# EAGLE design Stepper Motor Driver v1.1 (EAGLE 7.2.0)
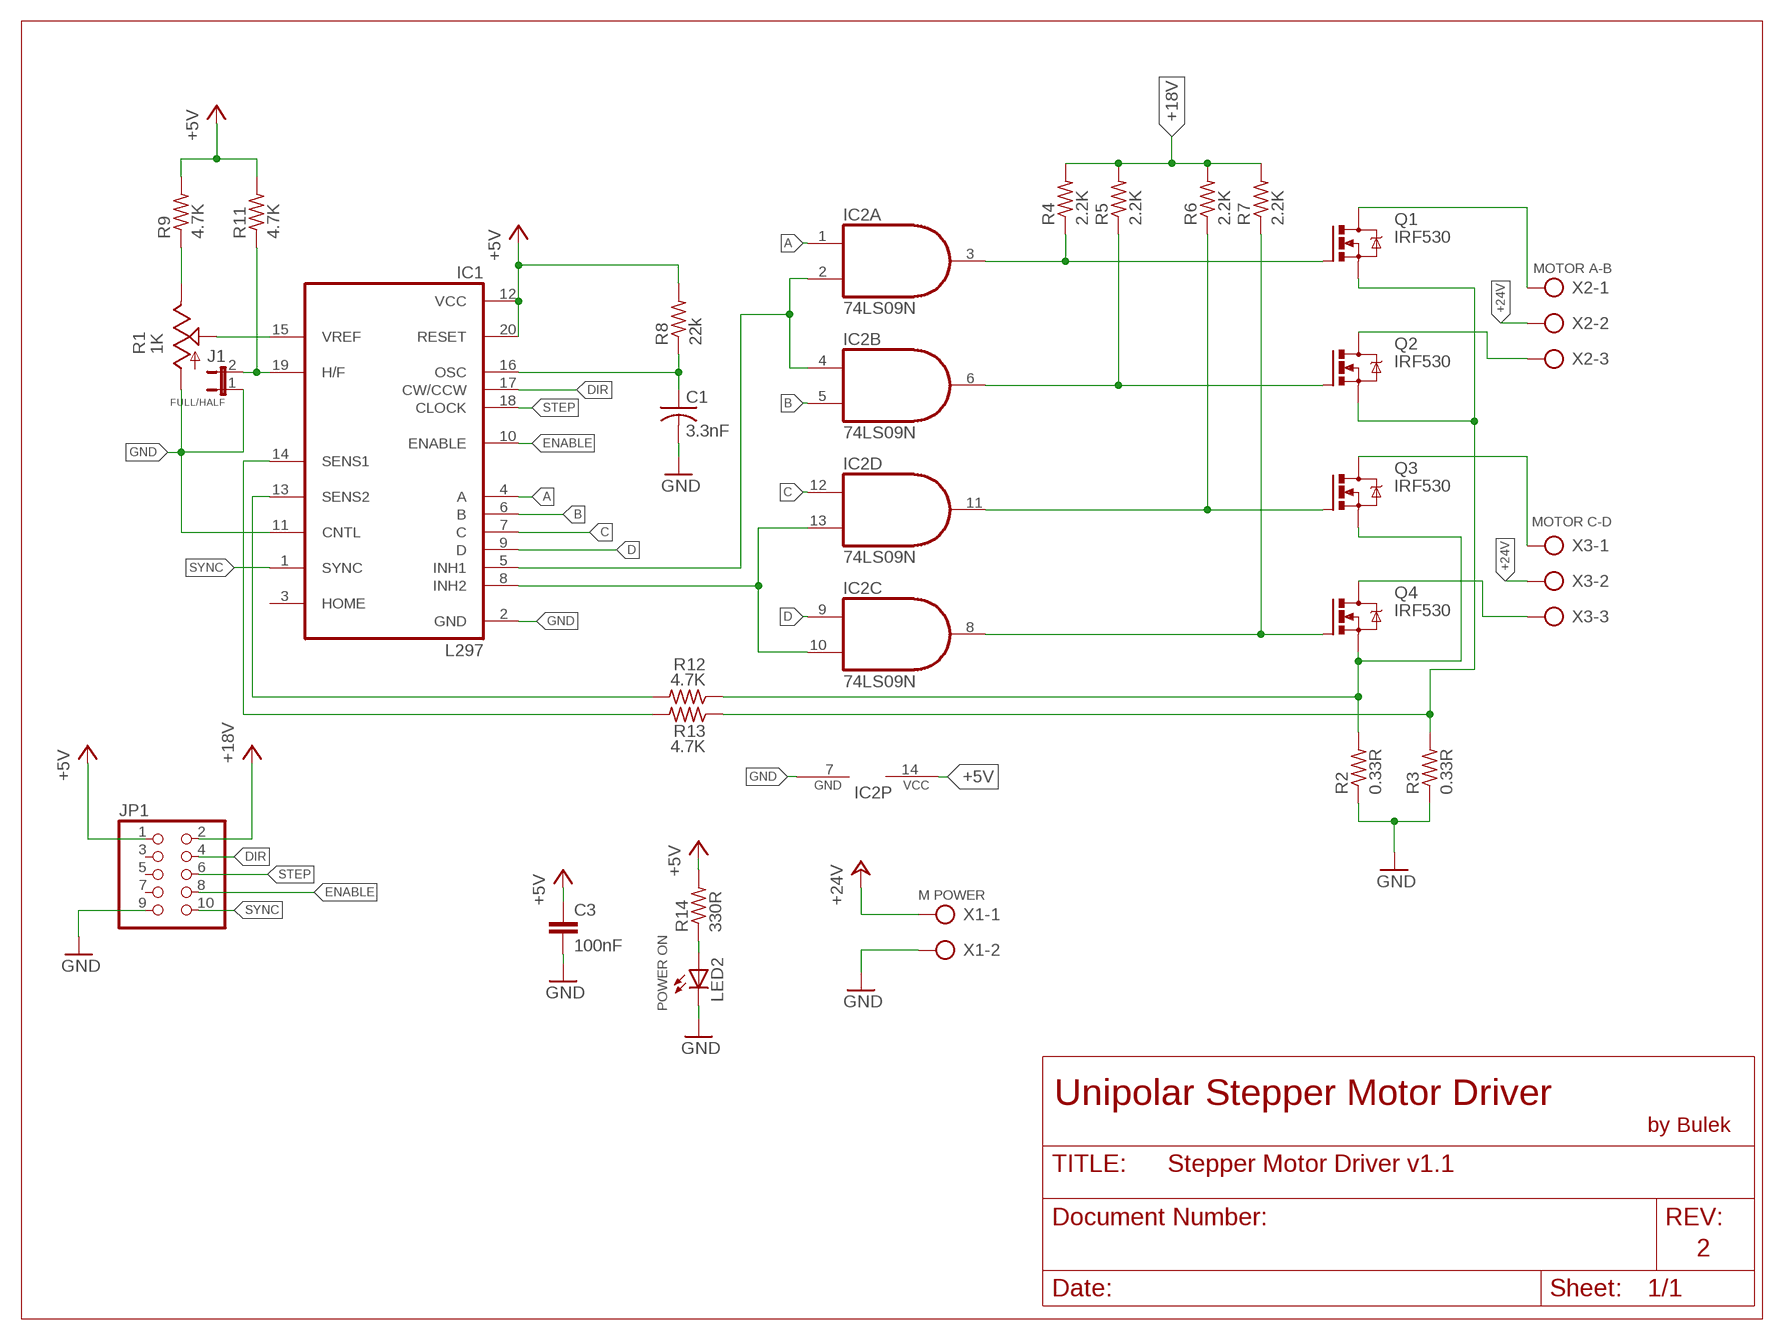
[diagram p0: schematic, sheet 1]

## Parts
C1  3.3nF  C-US025-024X044  [C025-024X044]
C3  100nF  C-EU025-025X050  [C025-025X050]
FULL/HALF  J1  JP1E  [JP1]
IC1  L297  [DIL20]
IC2  74LS09N  [DIL14]
JP1  PINHD-2X5  [2X05]
LED2  POWER ON  LED5MM  [LED5MM]
Q1  IRF530  [TO220BV]
Q2  IRF530  [TO220BV]
Q3  IRF530  [TO220BV]
Q4  IRF530  [TO220BV]
R1  1K  TRIM_US-S63X  [S63X]
R2  0.33R  R-US_0617/22  [0617/22]
R3  0.33R  R-US_0617/22  [0617/22]
R4  2.2K  R-US_0207/10  [0207/10]
R5  2.2K  R-US_0207/10  [0207/10]
R6  2.2K  R-US_0207/10  [0207/10]
R7  2.2K  R-US_0207/10  [0207/10]
R8  22k  R-US_0207/10  [0207/10]
R9  4.7K  R-US_0207/10  [0207/10]
R11  4.7K  R-US_0207/10  [0207/10]
R12  4.7K  R-US_0207/10  [0207/10]
R13  4.7K  R-US_0207/10  [0207/10]
R14  330R  R-US_0207/10  [0207/10]
X1  M POWER  AK300/2  [AK300/2]
X2  MOTOR A-B  AK300/3  [AK300/3]
X3  MOTOR C-D  AK300/3  [AK300/3]

## Nets
+5V: C3.1 IC1.12(VCC) IC1.20(RESET) IC2.14(P:VCC) JP1.1 R8.2 R9.2 R11.2 R14.2
+18V: JP1.2 R4.2 R5.2 R6.2 R7.2
+24V [POWER]: X1.1 X2.2 X3.2
A: IC1.4(A) IC2.1(A:I0)
B: IC1.6(B) IC2.5(B:I1)
C: IC1.7(C) IC2.12(D:I0)
D: IC1.9(D) IC2.9(C:I0)
DIR: IC1.17(CW/CCW) JP1.4
ENABLE: IC1.10(ENABLE) JP1.8
GND [GND]: C1.2 C3.2 FULL/HALF.1 IC1.2(GND) IC1.11(CNTL) IC2.7(P:GND) JP1.9 LED2.K(C) R1.A R2.1 R3.1 X1.2
INH1: IC1.5(INH1) IC2.2(A:I1) IC2.4(B:I0)
INH2: IC1.8(INH2) IC2.10(C:I1) IC2.13(D:I1)
N$1: R1.E R9.1
N$2: IC1.15(VREF) R1.S
N$3: C1.1 IC1.16(OSC) R8.1
N$6: FULL/HALF.2 IC1.19(H/F) R11.1
N$7: IC1.14(SENS1) R13.2
N$8: IC1.13(SENS2) R12.2
N$9: IC2.3(A:O) Q1.G R4.1
N$10: IC2.6(B:O) Q2.G R5.1
N$11: IC2.11(D:O) Q3.G R6.1
N$12: IC2.8(C:O) Q4.G R7.1
N$13 [POWER]: Q1.S Q2.S R3.2 R13.1
N$14 [POWER]: Q3.S Q4.S R2.2 R12.1
N$15 [POWER]: Q1.D X2.1
N$16 [POWER]: Q2.D X2.3
N$17 [POWER]: Q3.D X3.1
N$18 [POWER]: Q4.D X3.3
N$20: LED2.A R14.1
STEP: IC1.18(CLOCK) JP1.6
SYNC: IC1.1(SYNC) JP1.10
Unconnected: IC1.3(HOME) JP1.3 JP1.5 JP1.7

## Notes on the sheet
- Unipolar Stepper Motor Driver
- by Bulek
- 2

## Library data of the parts
C1 = rcl:C-US: CAPACITOR, American symbol
C3 = rcl:C-EU: CAPACITOR, European symbol
FULL/HALF = jumper:JP1E: JUMPER
IC1 = st-microelectronics:L297: STEPPER MOTOR CONTROLLER; MPN: L297/1; OC_FARNELL: 1094209; OC_NEWARK: 56P8258
IC2 = 74xx-us:74*09: Quad 2-input AND gate, open collector
JP1 = pinhead:PINHD-2X5: PIN HEADER
LED2 = led:LED: LED OSRAM: - CHIPLED LG R971, LG N971, LY N971, LG Q971, LY Q971, LO R971, LY R971 LH N974, LH R974 LS Q976, LO Q976, LY Q976 LO Q996 - Hyper CHIPLED LW Q18S LB Q993, LB Q99A, LB R99A - SideLED LS A670, LO A670, LY A670, LG A670, LP A670 LB A673, LV A673, LT A673, LW A673 LH A674 LY A675 LS A676, LA A676, LO A676, LY A676, LW A676 LS A679, LY A679, LG A679 - Hyper Micro SIDELED® LS Y876, LA Y876, LO Y876, LY Y876 LT Y87S - SmartLED LW L88C, LW L88S LB L89C, LB L89S, LG L890 LS L89K, LO L89K, LY L89K LS L896, LA L896, LO L896, LY L896 - TOPLED LS T670, LO T670, LY T670, LG T670, LP T670 LSG T670, LSP T670, LSY T670, LOP T670, LYG T670 LG T671, LOG T671, LSG T671 LB T673, LV T673, LT T673, LW T673 LH T674 LS T676, LA T676, LO T676, LY T676, LB T676, LH T676, LSB T676, LW T676 LB T67C, LV T67C, LT T67C, LS T67K, LO T67K, LY T67K, LW E67C LS E67B, LA E67B, LO E67B, LY E67B, LB E67C, LV E67C, LT E67C LW T67C LS T679, LY T679, LG T679 LS T770, LO T770, LY T770, LG T770, LP T770 LB T773, LV T773, LT T773, LW T773 LH T774 LS E675, LA E675, LY E675, LS T675 LS T776, LA T776, LO T776, LY T776, LB T776 LHGB T686 LT T68C, LB T68C - Hyper Mini TOPLED® LB M676 - Mini TOPLED Santana® LG M470 LS M47K, LO M47K, LY M47K Source: http://www.osram.convergy.de LUXEON: - LUMILED® LXK2-PW12-R00, LXK2-PW12-S00, LXK2-PW14-U00, LXK2-PW14-V00 LXK2-PM12-R00, LXK2-PM12-S00, LXK2-PM14-U00 LXK2-PE12-Q00, LXK2-PE12-R00, LXK2-PE12-S00, LXK2-PE14-T00, LXK2-PE14-U00 LXK2-PB12-K00, LXK2-PB12-L00, LXK2-PB12-M00, LXK2-PB14-N00, LXK2-PB14-P00, LXK2-PB14-Q00 LXK2-PR12-L00, LXK2-PR12-M00, LXK2-PR14-Q00, LXK2-PR14-R00 LXK2-PD12-Q00, LXK2-PD12-R00, LXK2-PD12-S00 LXK2-PH12-R00, LXK2-PH12-S00 LXK2-PL12-P00, LXK2-PL12-Q00, LXK2-PL12-R00 Source: www.luxeon.com KINGBRIGHT: KA-3528ASYC Source: www.kingbright.com
Q1-Q4 = transistor-power:IRF530: HEXFET Power MOSFET
R1 = pot:TRIM_US-: POTENTIOMETER
R2-R9 R11-R14 = resistor:R-US_: RESISTOR, American symbol
X1 = con-ptr500:AK300/2: CONNECTOR; OC_FARNELL: unknown; OC_NEWARK: unknown
X2 X3 = con-ptr500:AK300/3: CONNECTOR; OC_FARNELL: unknown; OC_NEWARK: unknown

## Net classes
0 default: width 1.219 mm
1 GND: width 1.626 mm
2 POWER: width 1.626 mm

## Board
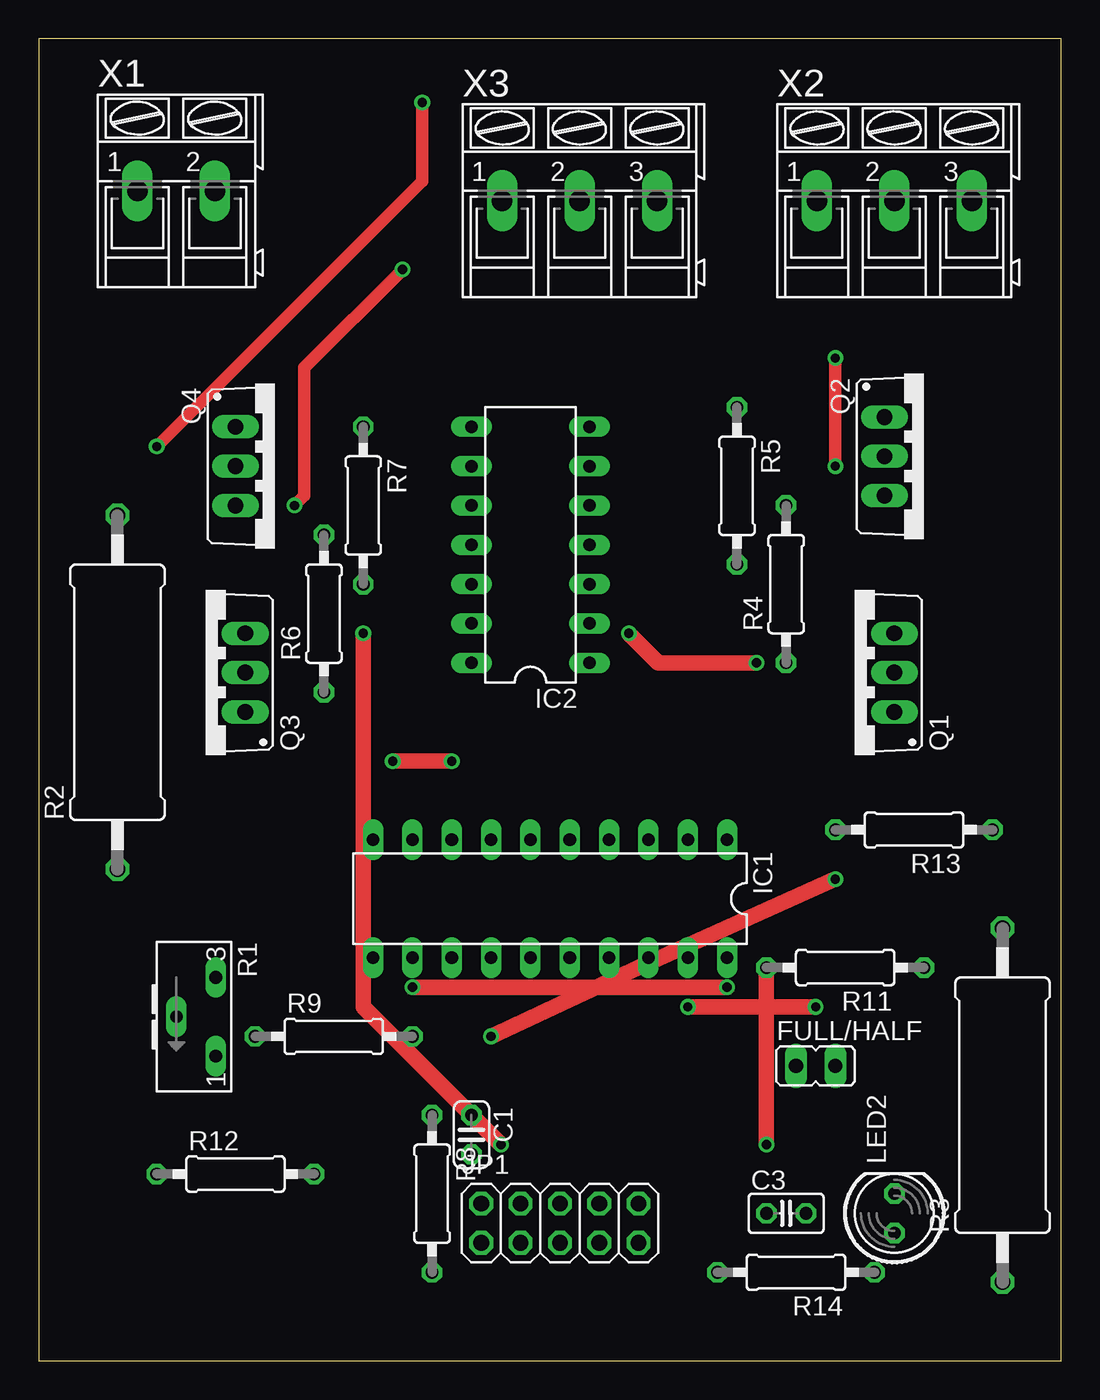
[diagram p1: board, top side]
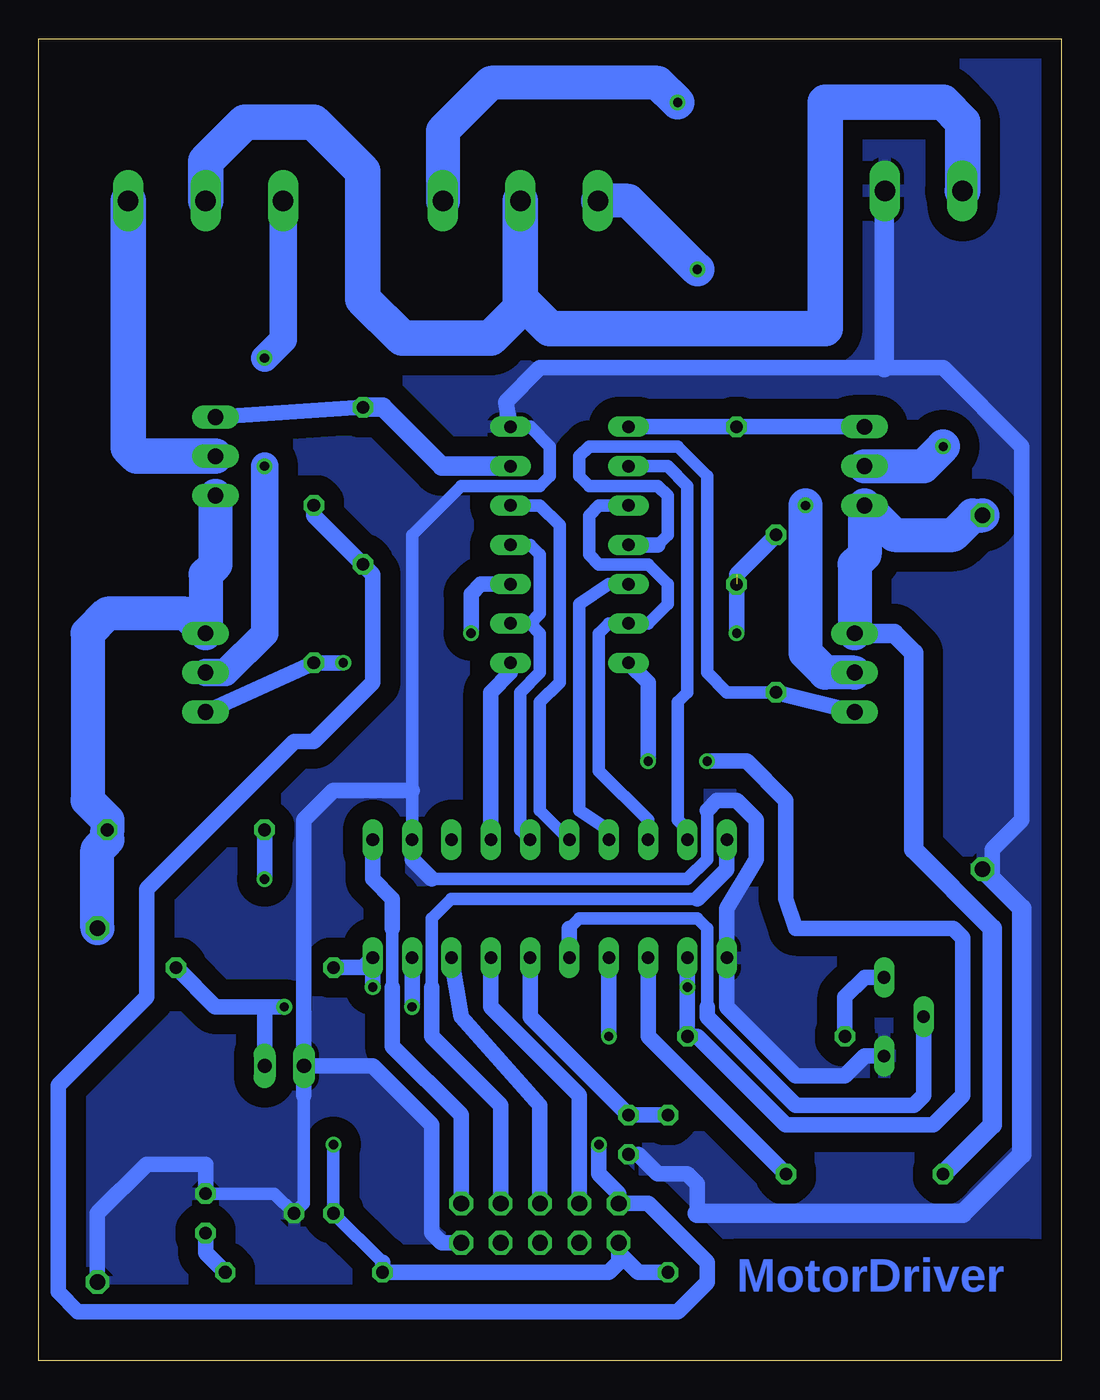
[diagram p2: board, bottom side, seen from below]

Size 66.02 x 85.4 mm. Coordinates in mm from the lower left corner, seen from the top.
Outline: 0,0 66.02,0 66.02,85.4 0,85.4 0,0
Copper layers (1*16): Top 0.035mm / dielectric 1.5mm / Bottom 0.035mm
Design rules "default": minimum track width 10mil, minimum drill 24mil, track to track 8mil, track to pad 8mil, pad to pad 8mil, via to via 8mil, smd to smd 8mil, copper to edge 40mil, drill to drill 8mil, minimum pad ring 10mil, minimum via ring 8mil, stop-mask expansion 4mil, vias tented up to drill 0mil, thermal gap 10mil

### Footprints (pad centres in the part's own frame; a part is rotated, then mirrored left to right if it is on the bottom)
C025-024X044 = drill 0.813 octagon: 1 -1.27,0; 2 1.27,0
C025-025X050 = drill 0.813 octagon: 1 -1.27,0; 2 1.27,0
JP1 = drill 0.914 long: 1 0,-1.27; 2 0,1.27
DIL20 = drill 0.813 long: 1 -11.43,-3.81; 2 -8.89,-3.81; 3 -6.35,-3.81; 4 -3.81,-3.81; 5 -1.27,-3.81; 6 1.27,-3.81; 7 3.81,-3.81; 8 6.35,-3.81; 9 8.89,-3.81; 10 11.43,-3.81; 11 11.43,3.81; 12 8.89,3.81; 13 6.35,3.81; 14 3.81,3.81; 15 1.27,3.81; 16 -1.27,3.81; 17 -3.81,3.81; 18 -6.35,3.81; 19 -8.89,3.81; 20 -11.43,3.81
DIL14 = drill 0.813 long: 1 -7.62,-3.81; 2 -5.08,-3.81; 3 -2.54,-3.81; 4 0,-3.81; 5 2.54,-3.81; 6 5.08,-3.81; 7 7.62,-3.81; 8 7.62,3.81; 9 5.08,3.81; 10 2.54,3.81; 11 0,3.81; 12 -2.54,3.81; 13 -5.08,3.81; 14 -7.62,3.81
2X05 = drill 1.016 octagon: 1 -5.08,-1.27; 2 -5.08,1.27; 3 -2.54,-1.27; 4 -2.54,1.27; 5 0,-1.27; 6 0,1.27; 7 2.54,-1.27; 8 2.54,1.27; 9 5.08,-1.27; 10 5.08,1.27
LED5MM = drill 0.813 octagon: A -1.27,0; K 1.27,0
TO220BV = drill 1.016 long: D 0,-2.54; G -2.54,-2.54; S 2.54,-2.54
S63X = drill 0.813 long: A 2.54,0; E -2.54,0; S 0,-2.54
0617/22 = drill 1.016 octagon: 1 -11.43,0; 2 11.43,0
0207/10 = drill 0.813 octagon: 1 -5.08,0; 2 5.08,0
AK300/2 = drill 1.321 long: 1 -2.515,0; 2 2.489,0
AK300/3 = drill 1.321 long: 1 -5.004,0; 2 0,0; 3 5.004,0

### Placement (x,y rotation side)
C1  27.94,14.61 270 top
C3  48.26,9.53 0 top
FULL/HALF  50.16,19.05 270 top
IC1  33.02,29.85 180 top
IC2  31.75,52.7 90 top
JP1  33.66,8.89 0 top
LED2  55.24,9.53 90 top
Q1  52.7,44.45 90 top
Q2  57.15,58.42 270 top
Q3  10.79,44.45 90 top
Q4  15.24,57.78 270 top
R1  11.43,22.23 270 top
R2  5.08,43.18 90 top
R3  62.23,16.51 90 top
R4  48.26,50.16 90 top
R5  45.09,56.52 270 top
R6  18.41,48.26 90 top
R7  20.95,55.24 270 top
R8  25.4,10.79 270 top
R9  19.05,20.96 0 top
R11  52.07,25.4 180 top
R12  12.7,12.06 0 top
R13  56.52,34.29 180 top
R14  48.9,5.71 180 top
X1  8.89,75.57 0 top
X2  55.24,74.93 0 top
X3  34.92,74.93 0 top

### Tracks (layer width: path | path; a pad name or v marks a point on that pad's centre or on a via)
+5V  (via drill 0.6)
  Top 1.016: v46.99,13.97 R11.2 | v24.13,24.13 v44.45,24.13 | v26.67,38.73 v22.86,38.73
  Bottom 0.813: v46.99,13.97 C3.1 43.81,6.35
  Bottom 1.016: JP1.1 28.57,6.98 | 28.57,6.98 28.57,6.35 29.21,5.71 R14.2 43.81,6.35 | R8.2 27.3,5.71 28.57,6.98 | R11.2 45.09,25.4 | 45.09,25.4 IC1.20 | 45.09,25.4 44.45,25.4 v44.45,24.13 | IC2.14 26.67,43.81 v26.67,38.73 | v22.86,38.73 20.32,38.73 17.78,36.2 17.78,29.85 17.14,27.94 6.99,27.94 6.35,27.31 6.35,17.15 8.26,15.24 17.78,15.24 23.5,20.96 R9.2 v24.13,24.13 IC1.12
  other vias: 46.99,25.4
+18V  (via drill 0.6)  (1 unrouted)
  Top 1.016: v29.84,13.97 20.95,22.86 v20.95,46.99
  Bottom 1.016: R4.2 48.26,54.61 R5.2 44.45,50.8 44.45,43.81 48.26,40 49.53,40 59.05,30.48 59.05,23.5 64.77,17.78 64.77,4.45 63.5,3.17 24.77,3.17 22.86,5.08 22.86,6.35 26.67,10.16 JP1.2 28.57,10.79 29.84,12.06 v29.84,13.97 | R6.2 20.95,50.8 v20.95,46.99
+24V
  Bottom 2.286: X1.1 6.35,75.59 6.35,80.01 7.62,81.28 15.24,81.28 15.24,66.68 33.02,66.68 34.92,68.58 X3.2 34.92,67.95 36.83,66.04 42.55,66.04 45.09,68.58 45.09,76.84 48.26,80.01 52.7,80.01 55.24,77.47 X2.2
A
  Bottom 1.016: IC1.4 36.83,43.18 35.56,44.45 IC2.1
B
  Bottom 0.813: IC1.6 33.66,35.56 33.66,42.54 32.38,43.81 32.38,53.98 33.66,55.24 IC2.5
C
  Bottom 0.813: IC2.12 29.21,50.16 31.11,48.89 31.11,35.56 29.21,34.29 IC1.7
D
  Bottom 0.813: IC1.9 24.13,34.29 24.77,34.92 24.77,42.54 24.13,43.18 24.13,56.52 25.4,57.78 IC2.9
DIR
  Bottom 1.016: JP1.4 31.11,17.15 36.83,22.86 IC1.17
ENABLE
  Bottom 0.813: 23.5,29.85 39.37,29.85 40.64,28.58 40.64,24.13
  Bottom 1.016: IC1.10 21.59,31.75 23.5,29.85 | 40.64,24.13 40.64,20.96 36.2,16.51 JP1.8
GND
  Bottom 0.813: 22.86,35.56 22.86,32.38 24.13,31.12 40.64,31.12 | IC1.2 41.91,36.83 41.91,53.34 38.73,56.52 33.66,56.52 33.02,57.15 33.02,59.05 34.29,60.32 IC2.7 35.88,60.64 35.88,61.91 | 48.9,18.42 48.9,10.16 C3.2 50.8,10.79 LED2.K
  Bottom 1.016: 22.86,35.56 22.23,36.2 20.95,36.2 19.68,34.92 19.68,32.38 21.59,29.21 IC1.11 21.59,22.86 17.14,18.42 13.97,18.42 12.7,19.69 R1.A | 40.64,31.12 41.91,32.38 IC1.2 | JP1.9 40.01,7.62 40.64,8.26 40.64,15.24 44.45,19.05 FULL/HALF.1 | 27.3,13.33 26.04,12.06 24.13,12.06 23.5,11.43 23.5,9.53 | 48.9,17.15 48.9,18.42 FULL/HALF.1 | 2.54,29.21 4.45,31.12 4.45,33.02 2.54,34.92 2.54,59.05 7.62,64.14 11.43,64.14 33.66,64.14 35.88,61.91 IC2.7 | R3.1 62.23,9.53 59.05,12.7 55.24,12.7 LED2.K | FULL/HALF.1 48.9,34.92 46.99,36.83 41.91,36.83
  Bottom 1.27: R2.1 2.54,29.21 2.54,13.33 6.35,9.53 23.5,9.53 | X1.2 11.43,75.51 11.43,64.14
  pour Bottom (isolate 1.27): 0.64,85.09 0.64,1.27 66.04,1.27 66.04,85.09
INH1
  Bottom 0.813: IC1.5 34.92,34.29 34.92,43.18 33.66,44.45 33.66,46.99 34.29,47.62 | IC2.2 34.29,47.62 | 34.29,47.62 33.66,48.26 33.66,52.07 34.29,52.7 IC2.4
INH2
  Bottom 0.813: IC1.8 26.67,34.92 29.84,38.1 29.84,46.99 29.21,47.62 IC2.13 26.67,47.62 25.4,48.89 25.4,50.16 26.67,51.43 29.84,51.43 30.48,52.07 30.48,54.61 29.84,55.24 IC2.10
N$1
  Bottom 1.016: R9.1 13.97,23.5 12.7,24.77 R1.E
N$2
  Bottom 0.813: 31.75,27.94 31.11,28.58 23.5,28.58 22.86,27.94 22.86,22.86
  Bottom 1.016: IC1.15 31.75,27.94 | 22.86,22.86 22.86,22.23 17.14,16.51 9.53,16.51 8.89,17.15 R1.S
N$3
  Bottom 1.016: R8.1 C1.1 34.29,22.23 IC1.16
N$6  (via drill 0.6)
  Top 1.016: v41.91,22.86 v50.16,22.86
  Bottom 1.016: IC1.19 v41.91,22.86 | v50.16,22.86 51.44,22.86 | 51.44,22.86 FULL/HALF.2 | 51.44,22.86 54.61,22.86 R11.1
N$7  (via drill 0.6)
  Top 1.016: v51.44,31.12 38.73,25.4 v29.21,20.96
  Bottom 1.016: R13.2 v51.44,31.12 | v29.21,20.96 IC1.14
N$8
  Bottom 1.016: R12.2 26.67,20.96 IC1.13
N$9  (via drill 0.6)
  Top 1.016: v38.1,46.99 40.01,45.09 v46.35,45.09
  Bottom 1.016: IC2.3 37.47,50.16 38.1,49.53 v38.1,46.99 | v46.35,45.09 R4.1 Q1.G
N$10
  Bottom 1.016: R5.1 Q2.G
  Bottom 1.27: IC2.6 40.01,57.78 43.81,61.59 R5.1
N$11
  Bottom 0.813: 26.04,52.7 25.4,53.34 25.4,55.88 26.04,56.52 30.48,56.52 31.11,57.15 31.11,58.42 30.48,59.05 24.77,59.05 22.86,57.15 22.86,44.45 21.59,43.18 R6.1
  Bottom 1.016: IC2.11 26.04,52.7 | R6.1 Q3.G
N$12
  Bottom 1.016: Q4.G R7.1 IC2.8
N$13
  Bottom 2.184: Q2.S 54.61,51.43 55.24,50.8 Q1.S 56.52,48.26 61.59,48.26 62.87,46.99 62.87,36.2 61.59,34.92 R13.1 61.59,33.66 62.23,33.02 R3.2
N$14
  Bottom 1.27: R12.1 4.45,15.24 4.45,27.94 9.53,33.02 9.53,45.72 10.79,46.99 Q3.S
  Bottom 2.184: Q3.S 13.34,51.43 12.7,52.07 Q4.S 10.79,53.34 6.99,53.34 5.71,54.61 R2.2
N$15  (via drill 0.6)
  Top 0.813: v51.44,57.78 v51.44,64.77
  Bottom 1.778: Q1.D 53.98,44.45 51.44,46.99 v51.44,57.78 | v51.44,64.77 50.24,65.96 X2.1
N$16
  Bottom 2.286: Q2.D 59.69,58.42 60.25,58.98 X2.3
N$17  (via drill 0.6)
  Top 0.813: v16.51,55.24 17.14,55.88 17.14,64.14 v23.5,70.48
  Bottom 2.184: Q3.D 15.24,44.45 16.51,45.72 v16.51,55.24 | v23.5,70.48 27.94,74.93 X3.1
N$18  (via drill 0.6)
  Top 0.813: v7.62,59.05 24.77,76.2 v24.77,81.28
  Bottom 2.184: Q4.D 8.89,57.78 v7.62,59.05 | v24.77,81.28 26.04,82.55 36.83,82.55 39.93,79.45 X3.3
N$20
  Bottom 1.016: R14.1 55.24,6.98 LED2.A
STEP
  Bottom 1.016: JP1.6 33.66,16.51 38.73,22.23 IC1.18
SYNC
  Bottom 0.813: 43.18,27.94 43.18,24.13
  Bottom 1.016: IC1.1 44.45,31.12 43.18,29.85 43.18,27.94 | 43.18,24.13 43.18,20.32 38.73,15.88 JP1.10

### Text on the board
Bottom: MotorDriver